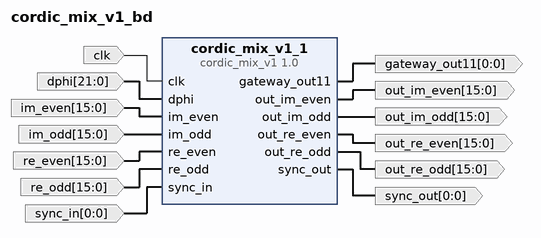
[diagram p0: block diagram of the top level]
# Vivado block design cordic_mix_v1_bd, xczu28dr-ffvg1517-2-e, Vivado 2020.2
create_bd_design cordic_mix_v1_bd

create_bd_port -dir I -type clk clk
create_bd_port -dir I -from 21 -to 0 -type data dphi
create_bd_port -dir O -from 0 -to 0 -type data gateway_out11
create_bd_port -dir I -from 15 -to 0 -type data im_even
create_bd_port -dir I -from 15 -to 0 -type data im_odd
create_bd_port -dir O -from 15 -to 0 -type data out_im_even
create_bd_port -dir O -from 15 -to 0 -type data out_im_odd
create_bd_port -dir O -from 15 -to 0 -type data out_re_even
create_bd_port -dir O -from 15 -to 0 -type data out_re_odd
create_bd_port -dir I -from 15 -to 0 -type data re_even
create_bd_port -dir I -from 15 -to 0 -type data re_odd
create_bd_port -dir I -from 0 -to 0 -type data sync_in
create_bd_port -dir O -from 0 -to 0 -type data sync_out

create_bd_cell -type ip -vlnv User_Company:SysGen:cordic_mix_v1:1.0 cordic_mix_v1_1

# ---- connections ----

connect_bd_net [get_bd_ports clk] [get_bd_pins cordic_mix_v1_1/clk]
connect_bd_net [get_bd_ports dphi] [get_bd_pins cordic_mix_v1_1/dphi]
connect_bd_net [get_bd_pins cordic_mix_v1_1/gateway_out11] [get_bd_ports gateway_out11]
connect_bd_net [get_bd_ports im_even] [get_bd_pins cordic_mix_v1_1/im_even]
connect_bd_net [get_bd_ports im_odd] [get_bd_pins cordic_mix_v1_1/im_odd]
connect_bd_net [get_bd_pins cordic_mix_v1_1/out_im_even] [get_bd_ports out_im_even]
connect_bd_net [get_bd_pins cordic_mix_v1_1/out_im_odd] [get_bd_ports out_im_odd]
connect_bd_net [get_bd_pins cordic_mix_v1_1/out_re_even] [get_bd_ports out_re_even]
connect_bd_net [get_bd_pins cordic_mix_v1_1/out_re_odd] [get_bd_ports out_re_odd]
connect_bd_net [get_bd_ports re_even] [get_bd_pins cordic_mix_v1_1/re_even]
connect_bd_net [get_bd_ports re_odd] [get_bd_pins cordic_mix_v1_1/re_odd]
connect_bd_net [get_bd_ports sync_in] [get_bd_pins cordic_mix_v1_1/sync_in]
connect_bd_net [get_bd_pins cordic_mix_v1_1/sync_out] [get_bd_ports sync_out]

validate_bd_design
save_bd_design
